# Altium schematic sheet vin_shunt.SchDoc
size A; SheetNumber: 6; SheetTotal: 6
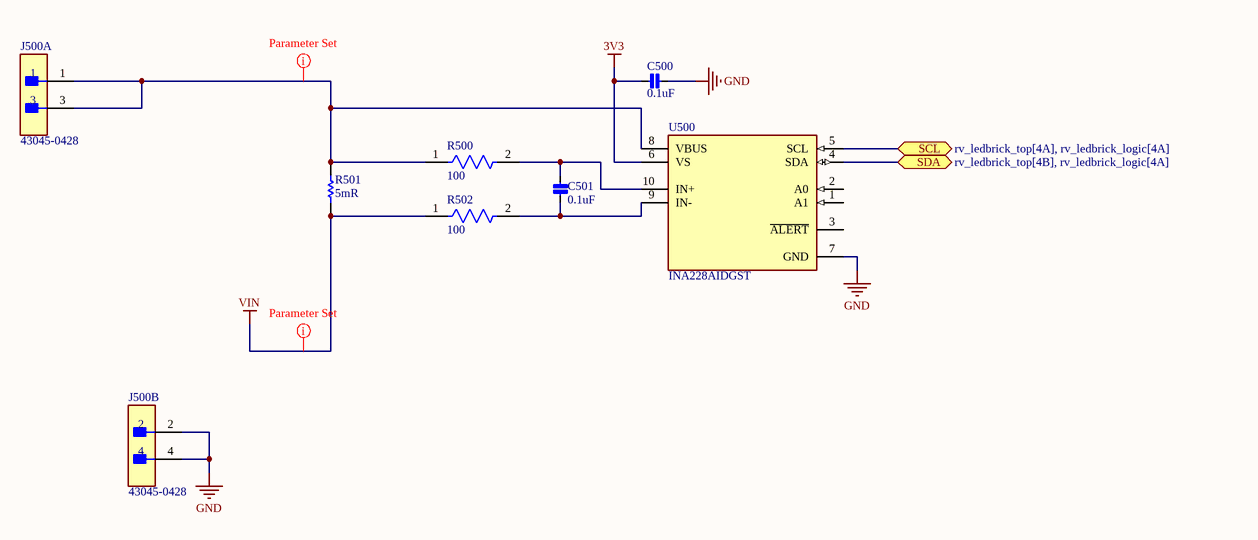
[diagram p0: vin_shunt.SchDoc]

## Parts
C500  value 0.1uF  [FP-CL10-IPC_B]  (hidden comment: CAP 0.1uF 50V X7R 0603)
C501  value 0.1uF  [FP-CL10-IPC_B]  (hidden comment: CAP 0.1uF 50V X7R 0603)
J500  43045-0428  [FP-43045-0428-MFG]  (parts A,B of 2)
R500  value 100  [FP-RC0603-0_55-MFG]  (hidden comment: 100R 0603 1%)
R501  value 5mR  [RESC7146X09N]  (hidden comment: 0R005 HOXLR2817-5W-5MR-1%)
R502  value 100  [FP-RC0603-0_55-MFG]  (hidden comment: 100R 0603 1%)
U500  INA228AIDGST  [FP-DGS0010A-IPC_C]

## Ports
SCL (bidir, see rv_ledbrick_top[4A], rv_ledbrick_logic[4A]), SDA (bidir, see rv_ledbrick_top[4B], rv_ledbrick_logic[4A])

## Nets
3V3: C500.1 U500.6(VS)
GND: C500.2 J500.2 J500.4 U500.7(GND)
VIN: R501.1 R502.1
SCL: U500.5(SCL) ; port SCL
SDA: U500.4(SDA) ; port SDA
NetC501_1: C501.1 R500.2 U500.10(IN+)
NetC501_2: C501.2 R502.2 U500.9(IN-)
NetJ500_1: J500.1 J500.3 R500.1 R501.2 U500.8(VBUS)

Not connected (* = marked no-connect by the designer): U500 1(A1) 2(A0) 3(~{ALERT})

## Layout directives
net class HV: NetJ500_1, VIN

## Library data of the parts
C500 C501 = CMP-001-00084-7: Cap Ceramic 0.1uF 50V X7R 20% SMD 0603 125C Paper T/R; Voltage: 50V
J500 = CMP-002-00096-1: PCB Header Temperature range: max. 105 °C Housing Material: Thermoplastic Poles: 4 Rated current: 5 A; Contact Gender: Male; Contact Material: Brass; Case/Package: 0428; Color: Black
R500 R502 = CMP-009-00246-1: Fixed Resistor, Metal Glaze/thick Film, 0.1W, 100ohm, 75V, 1% +/-Tol, 100ppm/Cel, Surface Mount, 0603; Package Width: 0.8mm; Package Length: 1.6mm; Package Height: 0.45mm; Power: 100mW; Temperature Coefficient: 100ppm/°C; Additional Feature: LASER TRIMMABLE; Rated Temperature: 70°C; Package Shape: Rectangular; RoHS Compliant: Yes; Mounting Technology: Surface Mount; Package Style: SMTMeter; Terminal Finish: Nickel; Min Operating Temperature: -55°C; Packaging: Tape and Reel; Technology: METAL GLAZE/THICK FILM; Case/Package: 0603; Pins: 2; Construction: Chip; Tolerance: 1%; JESD-609 Code: e3; Max Operating Temperature: 155°C; Reach SVHC Compliant: Yes; Working Voltage: 75V; Resistor Type: FIXED RESISTOR; Termination: Wraparound
R501 = CMP-009-00241-2: Res Metal Strip 2818 0.005 Ohm 1% 5W ±200ppm/°C Pad SMD Automotive T/R; Reach SVHC Compliant: Unknown; Min Operating Temperature: -65°C; Tolerance: 1%; Case Code (Metric): 7146; Max Power Dissipation: 5W; Width: 4.6mm; Resistor Type: Metal Strip; Radiation Hardening: No; Length: 0.28inch; Features: Moisture Resistant,Automotive AEC-Q200; Power Rating: 5W; Max Operating Temperature: 170°C; Series: WSH2818; Packaging: Cut Tape; Temperature Coefficient: 200ppm/°C; RoHS Compliant: Yes; Case/Package: 2818; Package Quantity: 1; Termination: SMD/SMT; Case Code (Imperial): 2818; Resistance Tolerance: 1%; Height: 0.055inch; Number of Terminations: 2
U500 = CMP-015-00018-1: Power Supply Support Circuit, Adjustable, 1 Channel, PDSO10